# Altium schematic sheet 452006257#BDU控制板5-传感器.SchDoc
size A3; SheetNumber: 13; SheetTotal: 14
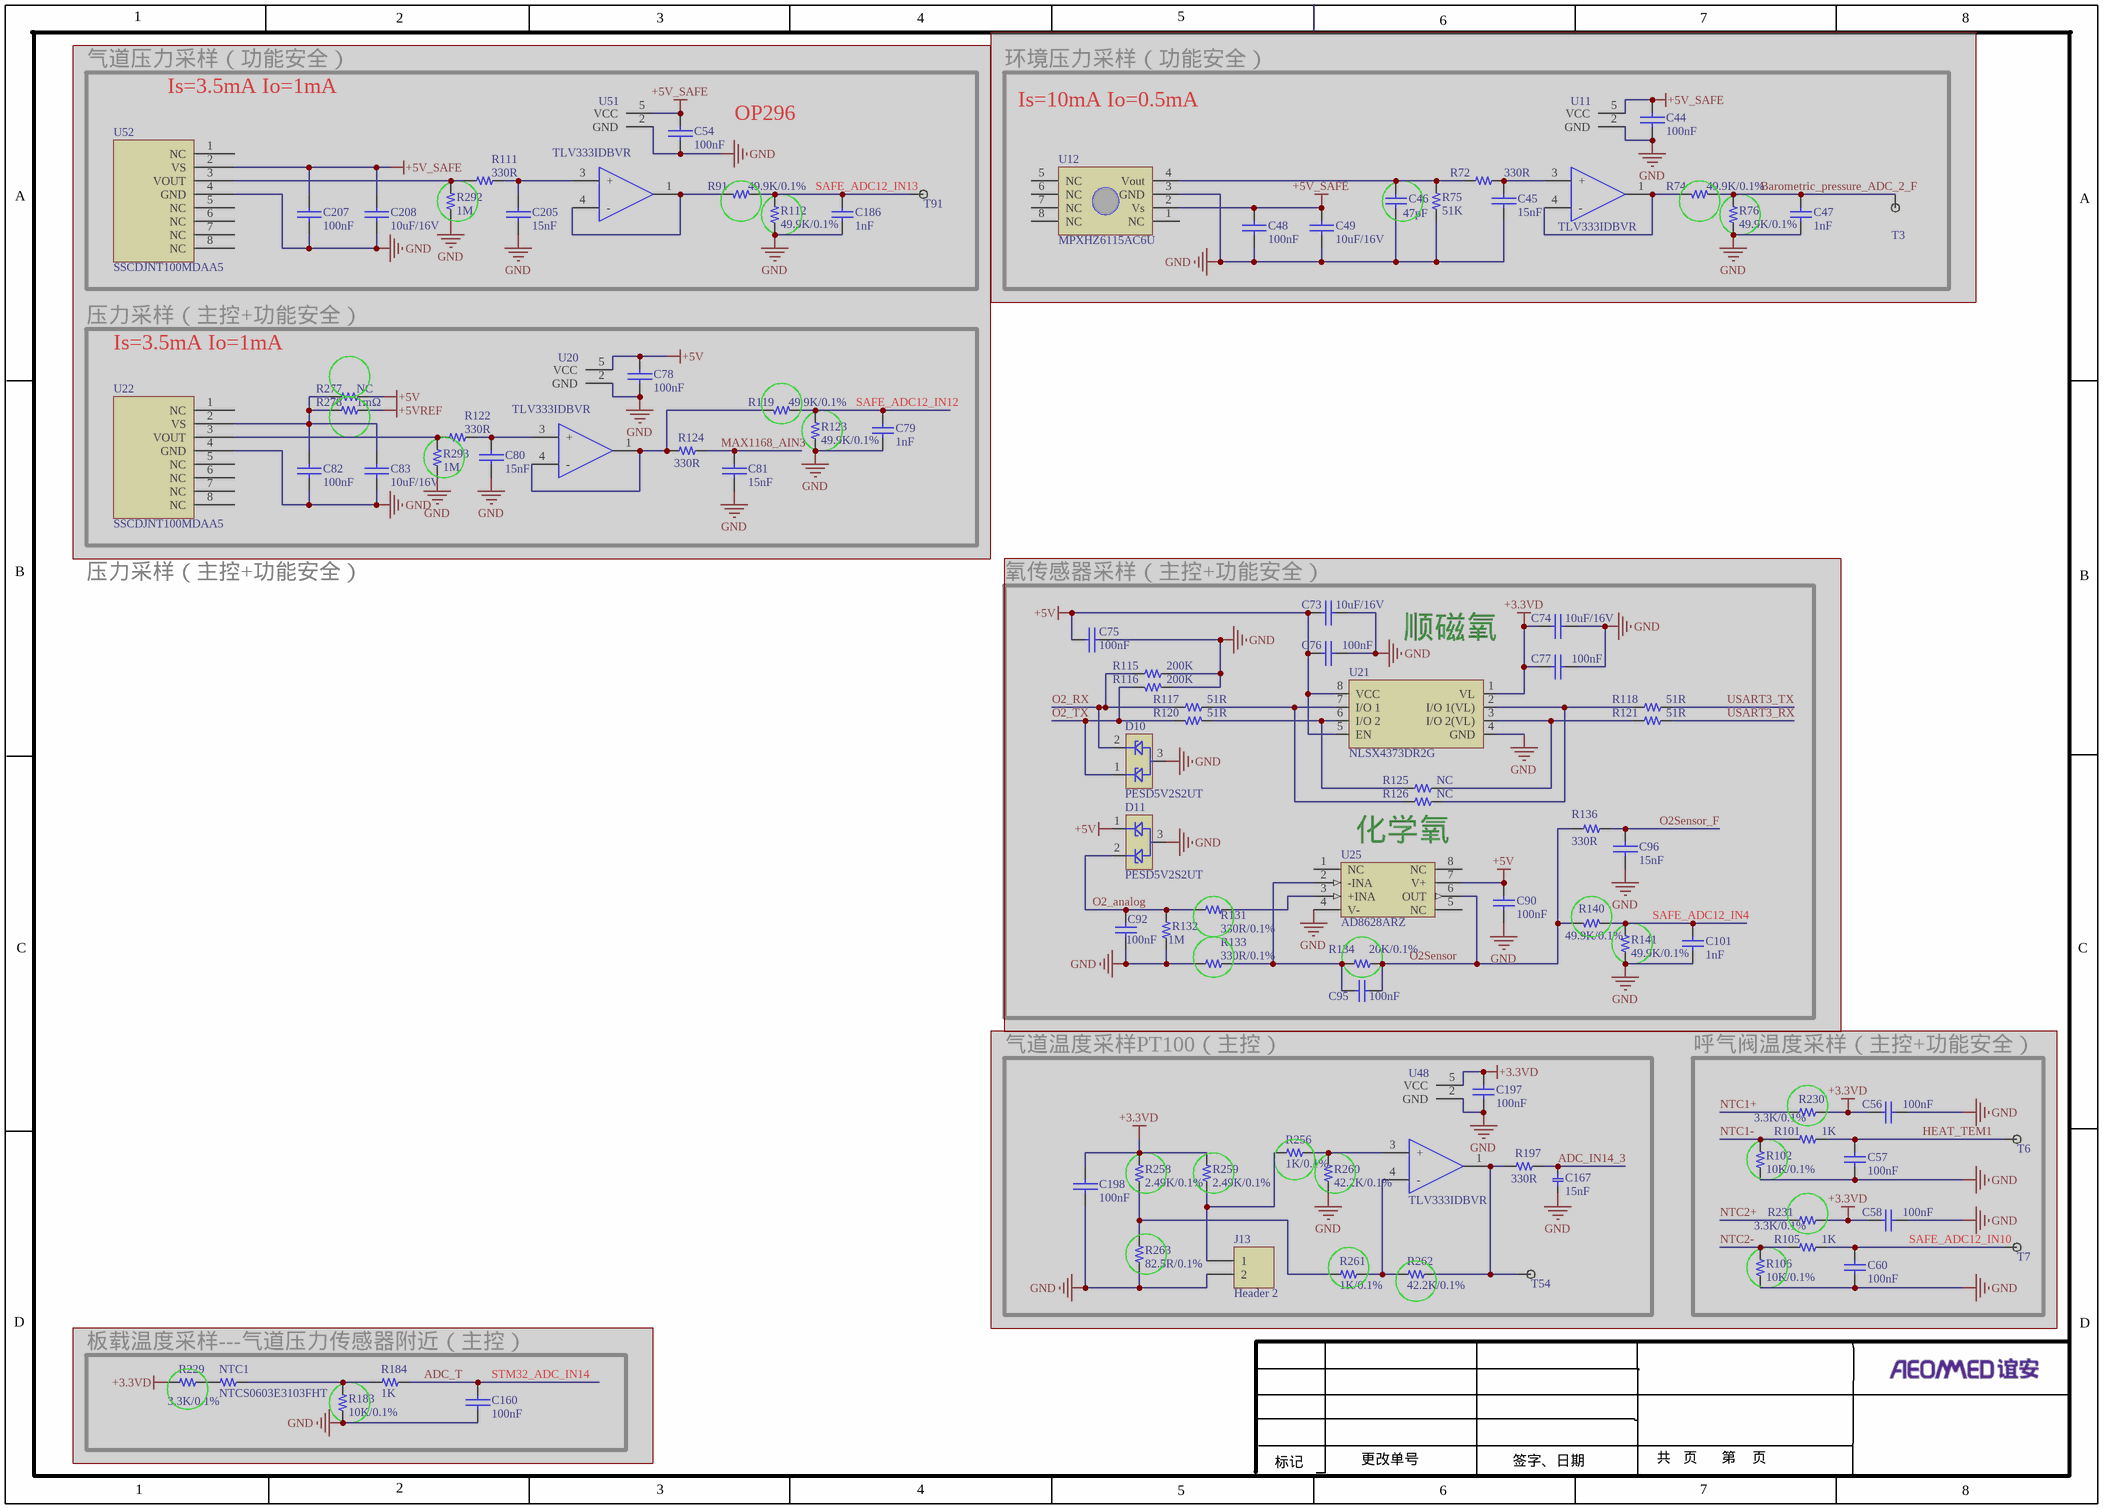
[diagram p0: 452006257#BDU控制板5-传感器.SchDoc]

## Parts
C44  100nF  [C-0603]  (masked out: inside a compile mask, not in the netlist)
C45  15nF  [C-0603]  (masked out: inside a compile mask, not in the netlist)
C46  47pF  [C-0603]  (masked out: inside a compile mask, not in the netlist)
C47  1nF  [C-0603]  (masked out: inside a compile mask, not in the netlist)
C48  100nF  [C-0603]  (masked out: inside a compile mask, not in the netlist)
C49  10uF/16V  [C-0805]  (masked out: inside a compile mask, not in the netlist)
C54  100nF  [C-0603]  (masked out: inside a compile mask, not in the netlist)
C56  100nF  [C-0603]  (masked out: inside a compile mask, not in the netlist)
C57  100nF  [C-0603]  (masked out: inside a compile mask, not in the netlist)
C58  100nF  [C-0603]  (masked out: inside a compile mask, not in the netlist)
C60  100nF  [C-0603]  (masked out: inside a compile mask, not in the netlist)
C73  10uF/16V  [C-0805]  (masked out: inside a compile mask, not in the netlist)
C74  10uF/16V  [C-0805]  (masked out: inside a compile mask, not in the netlist)
C75  100nF  [C-0603]  (masked out: inside a compile mask, not in the netlist)
C76  100nF  [C-0603]  (masked out: inside a compile mask, not in the netlist)
C77  100nF  [C-0603]  (masked out: inside a compile mask, not in the netlist)
C78  100nF  [C-0603]  (masked out: inside a compile mask, not in the netlist)
C79  1nF  [C-0603]  (masked out: inside a compile mask, not in the netlist)
C80  15nF  [C-0603]  (masked out: inside a compile mask, not in the netlist)
C81  15nF  [C-0603]  (masked out: inside a compile mask, not in the netlist)
C82  100nF  [C-0603]  (masked out: inside a compile mask, not in the netlist)
C83  10uF/16V  [C-0805]  (masked out: inside a compile mask, not in the netlist)
C90  100nF  [C-0603]  (masked out: inside a compile mask, not in the netlist)
C92  100nF  [C-0603]  (masked out: inside a compile mask, not in the netlist)
C95  100nF  [C-0603]  (masked out: inside a compile mask, not in the netlist)
C96  15nF  [C-0603]  (masked out: inside a compile mask, not in the netlist)
C101  1nF  [C-0603]  (masked out: inside a compile mask, not in the netlist)
C160  100nF  [C-0603]  (masked out: inside a compile mask, not in the netlist)
C167  15nF  [C-0603]  (masked out: inside a compile mask, not in the netlist)
C186  1nF  [C-0603]  (masked out: inside a compile mask, not in the netlist)
C197  100nF  [C-0603]  (masked out: inside a compile mask, not in the netlist)
C198  100nF  [C-0603]  (masked out: inside a compile mask, not in the netlist)
C205  15nF  [C-0603]  (masked out: inside a compile mask, not in the netlist)
C207  100nF  [C-0603]  (masked out: inside a compile mask, not in the netlist)
C208  10uF/16V  [C-0805]  (masked out: inside a compile mask, not in the netlist)
D10  PESD5V2S2UT  [sot23-3]  (masked out: inside a compile mask, not in the netlist)
D11  PESD5V2S2UT  [sot23-3]  (masked out: inside a compile mask, not in the netlist)
J13  Header 2  [JST_PA 2.00-2 Side entry]  (masked out: inside a compile mask, not in the netlist)
NTC1  NTCS0603E3103FHT  [R-0603]  (masked out: inside a compile mask, not in the netlist)
R72  330R  [R-0603]  (masked out: inside a compile mask, not in the netlist)
R74  49.9K/0.1%  [R-0603]  (masked out: inside a compile mask, not in the netlist)
R75  51K  [R-0603]  (masked out: inside a compile mask, not in the netlist)
R76  49.9K/0.1%  [R-0603]  (masked out: inside a compile mask, not in the netlist)
R91  49.9K/0.1%  [R-0603]  (masked out: inside a compile mask, not in the netlist)
R101  1K  [R-0603]  (masked out: inside a compile mask, not in the netlist)
R102  10K/0.1%  [R-0603]  (masked out: inside a compile mask, not in the netlist)
R105  1K  [R-0603]  (masked out: inside a compile mask, not in the netlist)
R106  10K/0.1%  [R-0603]  (masked out: inside a compile mask, not in the netlist)
R111  330R  [R-0603]  (masked out: inside a compile mask, not in the netlist)
R112  49.9K/0.1%  [R-0603]  (masked out: inside a compile mask, not in the netlist)
R115  200K  [R-0603]  (masked out: inside a compile mask, not in the netlist)
R116  200K  [R-0603]  (masked out: inside a compile mask, not in the netlist)
R117  51R  [R-0603]  (masked out: inside a compile mask, not in the netlist)
R118  51R  [R-0603]  (masked out: inside a compile mask, not in the netlist)
R119  49.9K/0.1%  [R-0603]  (masked out: inside a compile mask, not in the netlist)
R120  51R  [R-0603]  (masked out: inside a compile mask, not in the netlist)
R121  51R  [R-0603]  (masked out: inside a compile mask, not in the netlist)
R122  330R  [R-0603]  (masked out: inside a compile mask, not in the netlist)
R123  49.9K/0.1%  [R-0603]  (masked out: inside a compile mask, not in the netlist)
R124  330R  [R-0603]  (masked out: inside a compile mask, not in the netlist)
R125  NC  [R-0603]  (masked out: inside a compile mask, not in the netlist)
R126  NC  [R-0603]  (masked out: inside a compile mask, not in the netlist)
R131  330R/0.1%  [R-0603]  (masked out: inside a compile mask, not in the netlist)
R132  1M  [R-0603]  (masked out: inside a compile mask, not in the netlist)
R133  330R/0.1%  [R-0603]  (masked out: inside a compile mask, not in the netlist)
R134  20K/0.1%  [R-0603]  (masked out: inside a compile mask, not in the netlist)
R136  330R  [R-0603]  (masked out: inside a compile mask, not in the netlist)
R140  49.9K/0.1%  [R-0603]  (masked out: inside a compile mask, not in the netlist)
R141  49.9K/0.1%  [R-0603]  (masked out: inside a compile mask, not in the netlist)
R183  10K/0.1%  [R-0603]  (masked out: inside a compile mask, not in the netlist)
R184  1K  [R-0603]  (masked out: inside a compile mask, not in the netlist)
R197  330R  [R-0603]  (masked out: inside a compile mask, not in the netlist)
R229  3.3K/0.1%  [R-0603]  (masked out: inside a compile mask, not in the netlist)
R230  3.3K/0.1%  [R-0603]  (masked out: inside a compile mask, not in the netlist)
R231  3.3K/0.1%  [R-0603]  (masked out: inside a compile mask, not in the netlist)
R256  1K/0.1%  [R-0603]  (masked out: inside a compile mask, not in the netlist)
R258  2.49K/0.1%  [R-0603]  (masked out: inside a compile mask, not in the netlist)
R259  2.49K/0.1%  [R-0603]  (masked out: inside a compile mask, not in the netlist)
R260  42.2K/0.1%  [R-0603]  (masked out: inside a compile mask, not in the netlist)
R261  1K/0.1%  [R-0603]  (masked out: inside a compile mask, not in the netlist)
R262  42.2K/0.1%  [R-0603]  (masked out: inside a compile mask, not in the netlist)
R263  82.5R/0.1%  [R-0603]  (masked out: inside a compile mask, not in the netlist)
R277  NC  [R-0603]  (masked out: inside a compile mask, not in the netlist)
R278  1mΩ  [R-0603]  (masked out: inside a compile mask, not in the netlist)
R292  1M  [R-0603]  (masked out: inside a compile mask, not in the netlist)
R293  1M  [R-0603]  (masked out: inside a compile mask, not in the netlist)
T3  直插测试点  [DIPTP]  (value not drawn)  (masked out: inside a compile mask, not in the netlist)
T6  直插测试点  [DIPTP]  (value not drawn)  (masked out: inside a compile mask, not in the netlist)
T7  直插测试点  [DIPTP]  (value not drawn)  (masked out: inside a compile mask, not in the netlist)
T54  直插测试点  [DIPTP]  (value not drawn)  (masked out: inside a compile mask, not in the netlist)
T91  直插测试点  [DIPTP]  (value not drawn)  (masked out: inside a compile mask, not in the netlist)
U11  TLV333IDBVR  [SOT23-5]  (masked out: inside a compile mask, not in the netlist)
U12  MPXHZ6115AC6U  [1317]  (masked out: inside a compile mask, not in the netlist)
U20  TLV333IDBVR  [SOT23-5]  (masked out: inside a compile mask, not in the netlist)
U21  NLSX4373DR2G  [SOIC8]  (masked out: inside a compile mask, not in the netlist)
U22  SSCDJNT100MDAA5  [SSCDRR]  (masked out: inside a compile mask, not in the netlist)
U25  AD8628ARZ  [SOIC8]  (masked out: inside a compile mask, not in the netlist)
U48  TLV333IDBVR  [SOT23-5]  (masked out: inside a compile mask, not in the netlist)
U51  TLV333IDBVR  [SOT23-5]  (masked out: inside a compile mask, not in the netlist)
U52  SSCDJNT100MDAA5  [SSCDRR]  (masked out: inside a compile mask, not in the netlist)

## Blocks framed on the sheet
气道温度采样PT100（主控）: C167 C197 C198 J13 R197 R256 R258-R263 T54 U48
呼气阀温度采样（主控+功能安全）: C56-C58 C60 R101 R102 R105 R106 R230 R231 T6 T7
板载温度采样---气道压力传感器附近（主控）: C160 NTC1 R183 R184 R229

## Notes on the sheet
- 气道压力采样（功能安全）
- Is=3.5mA Io=1mA
- 环境压力采样（功能安全）
- Is=10mA Io=0.5mA
- OP296
- 压力采样（主控+功能安全）
- 氧传感器采样（主控+功能安全）
- 顺磁氧
- 化学氧
- 1
- 2
- 3
- 4
- 5
- 6
- 7
- 8
- A
- B
- C
- D
- 更改单号
- 共   页      第    页
- 标记
- 签字、日期

## Library data of the parts
C44 C45 C48 C49 C54 C73-C78 C80-C83 C96 C160 C198 C205 C207 C208 = CAP: Capacitor
C46 C90 C92 C95 = 100nF_1: 贴片瓷介电容100nF±5%,0805; 物料编号: 210001894; 详细描述: X7R,50V,三星CL21B104JBCNNNC; 版本: V1.00; 制造商: 三星; 名称: 贴片瓷介电容100nF±5%,0805
C47 C56-C58 C60 C79 C101 C186 C197 = C-0603: 物料编号: *; 物料名称: *; 厂家: *; 详细描述: *
C167 = 100nF_0805: 物料编号: 210001894; 详细描述: X7R,50V,三星CL21B104JBCNNNC; 版本: V1.00; 名称: 贴片瓷介电容100nF±5%,0805; 制造商: 三星
D10 D11 = PESDxS2UT
J13 = Header 2: Header, 2-Pin; LatestRevisionDate: 17-Jul-2002; LatestRevisionNote: Re-released for DXP Platform.; Publisher: Altium Limited
NTC1 R72 R101 R102 R105 R106 R111 R122 R124 R136 R183 R184 R197 R229-R231 R256 R258-R263 R277 R278 R292 R293 = R-0603
R74 R91 R119 R140 = 100Ω_1: 国巨RC0805FR-07100R; 物料编号: 210000765; 详细描述: 0805,1/8W,国巨RC0805FR-07100R; 制造商: 国巨; 版本: V1.00; 名称: 贴片电阻100±1%
R75 = 10K_1: 国巨RC0805FR-0710K; 版本: V1.00; 名称: 贴片电阻10K±1%; 物料编号: 210001830; 详细描述: 0805,1/8W,国巨RC0805FR-0710K; 制造商: 国巨
R76 R112 R123 R141 = 3.3K_1: 国巨RC0805FR-073K3; 物料编号: 210001835; 详细描述: 0805,1/8W,国巨RC0805FR-073K3; 制造商: 国巨; 版本: V1.00; 名称: 贴片电阻3.3K±1%
R115-R118 R120 R121 R125 R126 = 51Ω_1: 国巨RC0805FR-0751R; 物料编号: 210002130; 详细描述: 0805,1/8W,国巨RC0805FR-0751R; 制造商: 国巨; 版本: V1.00; 名称: 贴片电阻51±1%
R131 R133 = 330Ω_1: 国巨RC0805FR-07330R; 物料编号: 210000706; 详细描述: 0805,1/8W,国巨RC0805FR-07330R; 制造商: 国巨; 版本: V1.00; 名称: 贴片电阻330±1%
R132 = 1M_1: 国巨RC0805FR-071M; 物料编号: 210000749; 详细描述: 0805,1/8W,国巨RC0805FR-071M; 制造商: 国巨; 版本: V1.00; 名称: 贴片电阻1M±1%
R134 = 12K_1: 国巨RC0805FR-0712K; 物料编号: 210000764; 详细描述: 0805,1/8W,国巨RC0805FR-0712K; 制造商: 国巨; 版本: V1.00; 名称: 贴片电阻12K±1%
T3 T6 T7 T54 T91 = Testpiont: 版本: V1.00; 名称: 直插测试点
U11 U20 U48 U51 = TLV333IDBVR: 品牌：TI，型号：TLV333IDBVR,SOIC-8,–25°~+85°C,单运放，ROHS
U12 = MPXHZ6115AC6U: 名称: 芯片MPXHZ6115AC6U; 版本: V1.00; 物料编号: APPLY; 制造商: freescale; 详细描述: 贴片大气压传感器，1.5%最大误差。
U21 = NLSX4373: 制造商: ON
U22 U52 = SSCMJJ010KDAA5
U25 = AD8628ARZ: 版本: V1.00; 名称: 芯片AD8628ARZ; 物料编号: 210001135; 详细描述: 精密运放AD8628ARZ ,SOIC8,-40℃+125℃; 制造商: ADI